# EAGLE design Schematic v2 (EAGLE 9.6.2)
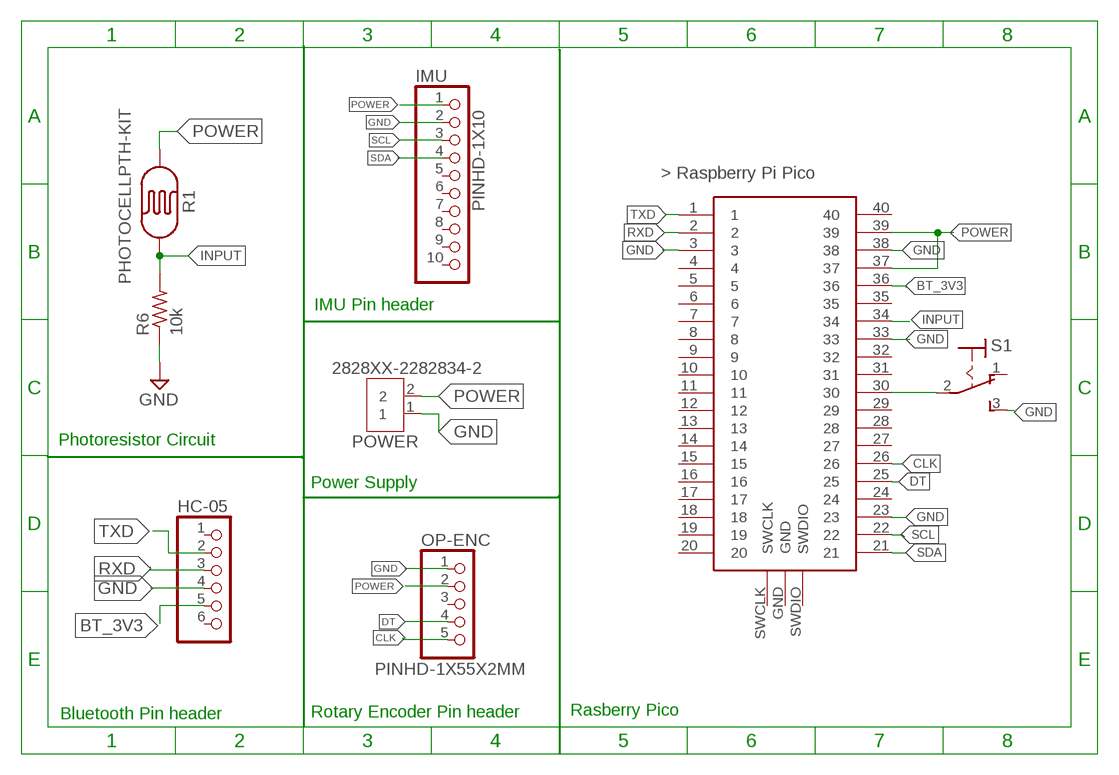
[diagram p0: schematic, sheet 1]

## Parts
HC-05  PINHD-1X6  [1X06]
IMU  PINHD-1X10  [1X10-BIG]
OP-ENC  PINHD-1X55X2MM  [1_05X2MM]
PICO  RASPBERRY-PI-PICO_TH  [FT_RASPBERRY-PI-PICO_TH]
POWER  2828XX-2282834-2  [TERMBLK_254-2N]
R1  PHOTOCELLPTH-KIT  [PHOTOCELL-KIT]
R6  10k  RESISTOR_1/4W_0207/10  [0207/10]
S1  320-916  [320-916]

## Nets
BT_3V3: HC-05.5 PICO.36
CLK: OP-ENC.5 PICO.26
DT: OP-ENC.4 PICO.25
GND: HC-05.4 IMU.2 OP-ENC.1 PICO.3 PICO.23 PICO.33 PICO.38 POWER.1 R6.1 S1.3(S)
INPUT: PICO.34 R1.1 R6.2
N$1: PICO.30 S1.2(P)
POWER: IMU.1 OP-ENC.2 PICO.37 PICO.39 POWER.2 R1.2
RXD: HC-05.3 PICO.2
SCL: IMU.3 PICO.22
SDA: IMU.4 PICO.21
TXD: HC-05.2 PICO.1
Unconnected: HC-05.1 HC-05.6 IMU.5 IMU.6 IMU.7 IMU.8 IMU.9 IMU.10 OP-ENC.3 PICO.4 PICO.5 PICO.6 PICO.7 PICO.8 PICO.9 PICO.10 PICO.11 PICO.12 PICO.13 PICO.14 PICO.15 PICO.16 PICO.17 PICO.18 PICO.19 PICO.20 PICO.24 PICO.27 PICO.28 PICO.29 PICO.31 PICO.32 PICO.35 PICO.40 PICO.GND PICO.SWCLK PICO.SWDIO S1.1(O)

## Notes on the sheet
- IMU Pin header
- Photoresistor Circuit
- Power Supply
- Bluetooth Pin header | Rotary Encoder Pin header | Rasberry Pico

## Library data of the parts
HC-05 = adafruit:PINHD-1X6: PIN HEADER
IMU = adafruit:PINHD-1X10: Pin header 1x10 0.1" spacing With round pins
OP-ENC = Connector:PINHD-1X5: PIN HEADER; CATEGORY: CONNECTOR; SUB-CATEGORY: PIN-HEADER
PICO = pipico:RASPBERRY-PI-PICO_TH: Raspberry Pi Pico microcontroller board for through-hole mounting.
POWER = Connector:2828XX-2: 2 Position Wire to Board Terminal Block Horizontal with Board Datasheet <https://www.te.com.cn/commerce/DocumentDelivery/DDEController?Action=showdoc&DocId=Catalog+Section%7F1308389_EUROSTYLE_TERMINAL_BLOCKS%7F0607%7Fpdf%7FEnglish%7FENG_CS_1308389_EUROSTYLE_TERMINAL_BLOCKS_0607.pdf%7F2-282837-5>
R1 = SparkFun-Sensors:PHOTOCELL: CdS photoresistor. This is a low cost way to detect light levels. Resistance decreases with more incoming light. SparkFun SKU: SEN-09088
R6 = BASIC_Components:RESISTOR_1/4W_0207/10
S1 = switch:320-916: TOGGLE SWITCH distributor RS Components

## Board
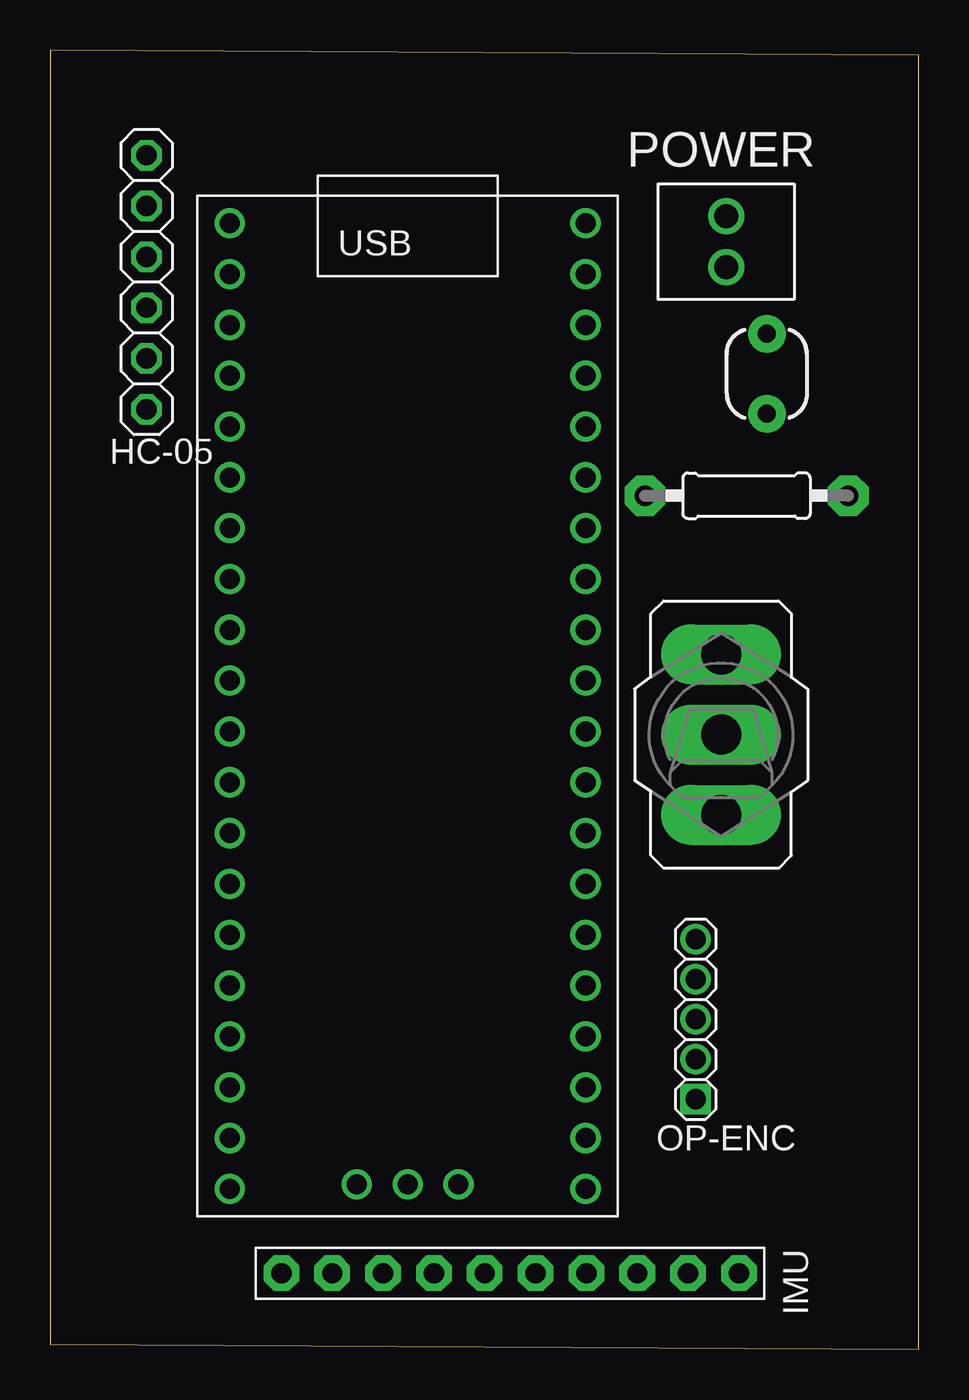
[diagram p1: board, top side]
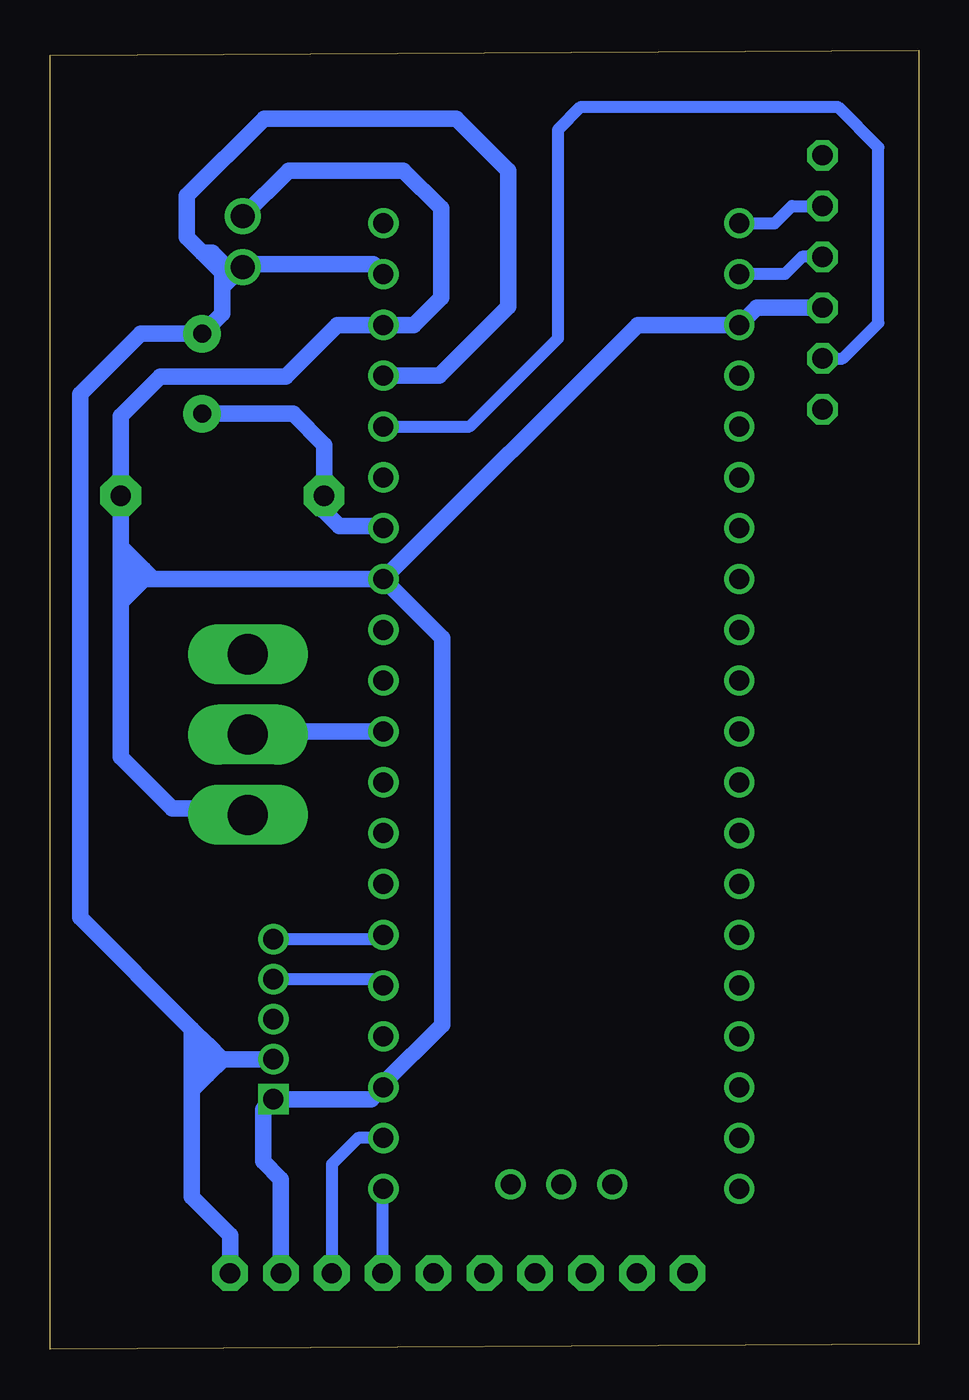
[diagram p2: board, bottom side, seen from below]

Size 43.41 x 64.95 mm. Coordinates in mm from the lower left corner, seen from the top.
Outline: 0,0.25 43.41,0 43.41,64.69 0,64.95 0,0.25
Copper layers (1*16): Top 0.035mm / dielectric 1.5mm / Bottom 0.035mm
Design rules "default *": minimum track width 6mil, minimum drill 0.8mm, track to track 20mil, track to pad 20mil, pad to pad 20mil, via to via 20mil, smd to smd 20mil, copper to edge 40mil, drill to drill 20mil, minimum pad ring 10mil, minimum via ring 8mil, stop-mask expansion 4mil, vias tented up to drill 0mil, thermal gap 10mil

### Footprints (pad centres in the part's own frame; a part is rotated, then mirrored left to right if it is on the bottom)
1X06 = drill 1.016 octagon: 1 -6.35,0; 2 -3.81,0; 3 -1.27,0; 4 1.27,0; 5 3.81,0; 6 6.35,0
1X10-BIG = drill 1.016 pad 1.778 octagon: 1 -11.43,0; 2 -8.89,0; 3 -6.35,0; 4 -3.81,0; 5 -1.27,0; 6 1.27,0; 7 3.81,0; 8 6.35,0; 9 8.89,0; 10 11.43,0
1_05X2MM = drill 1.016 pad 1.3 square: 1 -4,0 | drill 1.016 pad 1.3: 2 -2,0; 3 0,0; 4 2,0; 5 4,0
FT_RASPBERRY-PI-PICO_TH = drill 1: 1 -8.55,24.03; 2 -8.55,21.49; 3 -8.55,18.95; 4 -8.55,16.41; 5 -8.55,13.87; 6 -8.55,11.33; 7 -8.55,8.79; 8 -8.55,6.25; 9 -8.55,3.71; 10 -8.55,1.17; 11 -8.55,-1.37; 12 -8.55,-3.91; 13 -8.55,-6.45; 14 -8.55,-8.99; 15 -8.55,-11.53; 16 -8.55,-14.07; 17 -8.55,-16.61; 18 -8.55,-19.15; 19 -8.55,-21.69; 20 -8.55,-24.23; 21 9.23,-24.23; 22 9.23,-21.69; 23 9.23,-19.15; 24 9.23,-16.61; 25 9.23,-14.07; 26 9.23,-11.53; 27 9.23,-8.99; 28 9.23,-6.45; 29 9.23,-3.91; 30 9.23,-1.37; 31 9.23,1.17; 32 9.23,3.71; 33 9.23,6.25; 34 9.23,8.79; 35 9.23,11.33; 36 9.23,13.87; 37 9.23,16.41; 38 9.23,18.95; 39 9.23,21.49; 40 9.23,24.03; GND 0.34,-24; SWCLK -2.2,-24; SWDIO 2.88,-24
TERMBLK_254-2N = drill 1.2: 1 0,0; 2 2.54,0
PHOTOCELL-KIT = drill 0.9 pad 1.88: 1 -2,0; 2 2,0
0207/10 = drill 1.016 pad 2.032 octagon: 1 -5.08,0; 2 5.08,0
320-916 = drill 2.007 long: 1 0,4.013; 2 0,0; 3 0,-4.013

### Placement (x,y rotation side)
HC-05  4.83,53.34 270 top
IMU  22.99,3.81 180 top
OP-ENC  32.26,16.51 90 top
PICO  17.53,32.26 0 top
POWER  33.78,56.64 270 top
R1  35.81,48.77 90 top
R6  34.8,42.67 180 top
S1  33.53,30.73 0 top

### Tracks (layer width: path | path; a pad name or v marks a point on that pad's centre or on a via)
BT_3V3
  Bottom 0.61: HC-05.5 3.81,49.53 2.03,51.31 2.03,60.07 4.06,62.1 16.89,62.1 18.03,60.96 18.03,50.55 22.45,46.13 PICO.36
CLK
  Bottom 0.61: OP-ENC.5 26.97,20.51 PICO.26
DT
  Bottom 0.61: OP-ENC.4 27.08,18.51 PICO.25
GND
  Bottom 0.813: POWER.1 31.5,58.93 25.77,58.93 23.88,57.04 23.88,52.58 25.25,51.21 PICO.38 29.06,51.21 31.64,48.62 37.9,48.62 39.88,46.65 R6.1 | HC-05.4 8.11,52.07 PICO.3 14.06,51.21 PICO.33 | PICO.33 38.25,38.51 | R6.1 39.88,40.13 38.73,38.99 | 38.73,38.99 38.25,38.51 | IMU.2 31.88,8.51 32.77,9.4 32.77,12 OP-ENC.1 27.35,12.51 PICO.23 26.76,13.29 23.82,16.23 23.82,35.57 PICO.33 | S1.3 33.85,27.04 37.3,27.04 39.88,29.62 39.88,37.34 | 39.88,37.34 39.88,38.61 | 39.88,38.61 R6.1 | 38.71,38.51 39.78,38.51 39.88,38.61 | 38.73,38.99 39.5,38.99 39.88,38.61 | 38.25,38.51 38.71,38.51 | 38.71,38.51 39.88,37.34
INPUT
  Bottom 0.813: PICO.34 26.86,41.15 28.96,41.15 29.72,41.91 R6.2 29.72,45.21 31.27,46.77 R1.1
N$1
  Bottom 0.406: 33.37,30.89 S1.2
  Bottom 0.813: PICO.30 33.37,30.89
POWER
  Bottom 0.813: IMU.1 34.42,5.71 36.32,7.62 36.32,12.95 | 36.32,12.95 35.56,13.72 | 35.56,13.72 34.77,14.51 OP-ENC.2 34.83,14.51 35.56,15.24 | 35.56,15.24 36.32,16 | 36.32,16 41.91,21.59 41.91,47.75 38.89,50.77 R1.2 34.8,51.78 34.8,53.09 | PICO.39 27.26,54.26 33.63,54.26 POWER.2 34.04,53.85 | 34.8,53.09 34.04,53.85 | 35.56,15.24 35.56,13.72 | 36.32,12.95 36.32,16 | PICO.37 23.98,48.67 20.52,52.12 20.52,58.93 23.11,61.52 32.72,61.52 36.58,57.66 36.58,55.6 35.8,54.83 | 35.8,54.83 35.31,54.83 34.33,53.85 34.04,53.85 | 34.8,53.09 34.8,53.82 35.8,54.83
RXD
  Bottom 0.61: HC-05.3 5.84,54.61 6.7,53.75 PICO.2
SCL
  Bottom 0.61: PICO.22 28.03,10.57 29.34,9.26 IMU.3
SDA
  Bottom 0.406: 26.8,7.99 PICO.21
  Bottom 0.61: IMU.4 26.8,7.99
TXD
  Bottom 0.61: PICO.1 7.21,56.29 6.35,57.15 HC-05.2